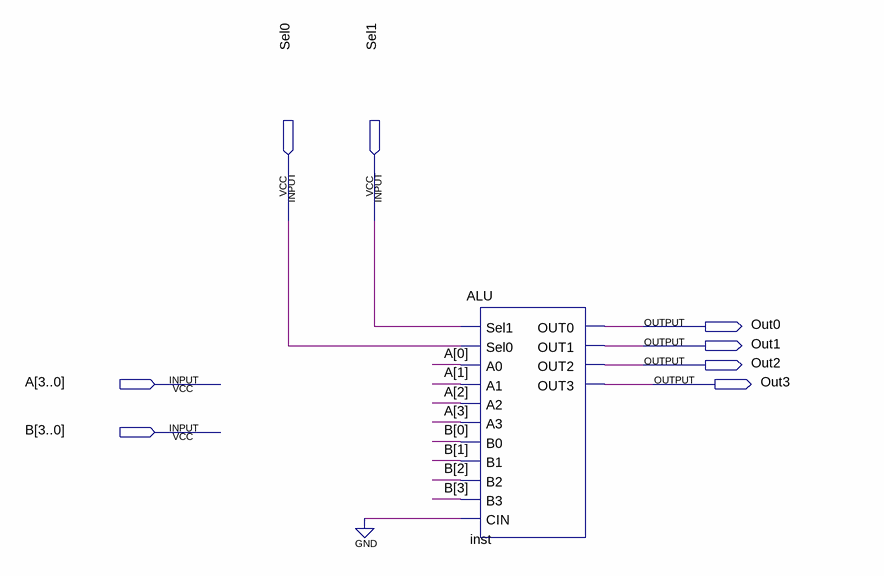
[diagram p0: schematic sheet]
// Quartus schematic ALU_Block.bdf as structural Verilog: 1 symbols, 8 pins
module ALU_Block (
  input  Sel0,
  input  Sel1,
  input  [3:0] A,
  input  [3:0] B,
  output Out0,
  output Out1,
  output Out2,
  output Out3
);

  ALU inst (
    .Sel1(Sel1), .Sel0(Sel0), .A0(A[0]), .A1(A[1]), .A2(A[2]), .A3(A[3]), .B0(B[0]), .B1(B[1]), .B2(B[2]),
    .B3(B[3]), .CIN(1'b0), .OUT0(Out0), .OUT1(Out1), .OUT2(Out2), .OUT3(Out3));
endmodule
